# EAGLE design HC-06_Arduino_UNO_Adapter (EAGLE 7.4.0)
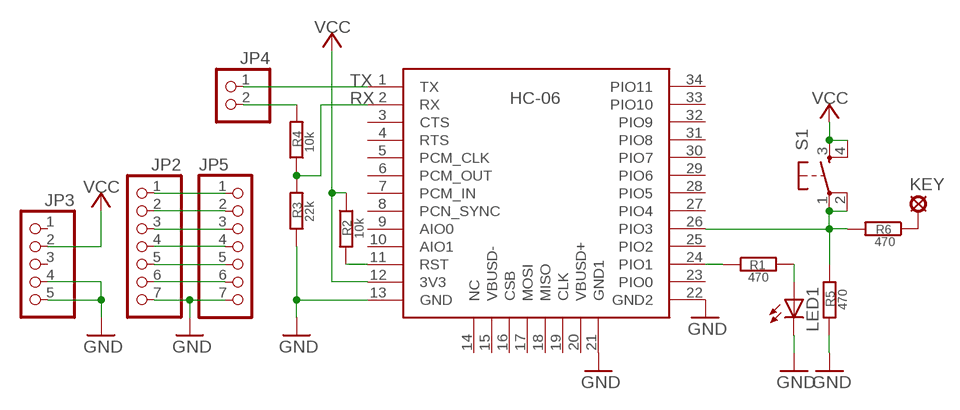
[diagram p0: schematic, sheet 1]

## Parts
HC-06  HC_05  [BLUETOOTH_SMD]
JP2  PINHD-1X7  [1X07]
JP3  PINHD-1X5  [1X05]
JP4  PINHD-1X2  [1X02]
JP5  PINHD-1X7  [1X07]
KEY  LSP10  [LSP10]
LED1  LED3MM  [LED3MM]
R1  470  R-EU_0204/5  [0204/5]
R2  10k  R-EU_0204/5  [0204/5]
R3  22k  R-EU_0204/5  [0204/5]
R4  10k  R-EU_0204/5  [0204/5]
R5  470  R-EU_0204/5  [0204/5]
R6  470  R-EU_0204/5  [0204/5]
S1  TACTILE-SWITCH-PTH  [TAC-SWITCH-PTH]

## Nets
GND: HC-06.13(GND) HC-06.21(GND1) HC-06.22(GND2) JP2.7 JP3.4 JP3.5 JP5.7 LED1.K(C) R3.1 R5.2
KEY: KEY.MP R6.1
N$1: LED1.A R1.2
N$2: HC-06.24(PIO1) R1.1
N$3: HC-06.11(RST) R2.2
N$4: JP2.1 JP5.1
N$5: JP2.2 JP5.2
N$6: JP2.3 JP5.3
N$7: JP2.4 JP5.4
N$8: HC-06.26(PIO3) R5.1 R6.2 S1.1 S1.2
N$9: JP4.2 R4.2
N$11: JP2.5 JP5.5
N$12: JP2.6 JP5.6
RX: HC-06.2(RX) R3.2 R4.1
TX: HC-06.1(TX) JP4.1
VCC: HC-06.12(3V3) JP3.2 R2.1 S1.3 S1.4
Unconnected: HC-06.3(CTS) HC-06.4(RTS) HC-06.5(PCM_CLK) HC-06.6(PCM_OUT) HC-06.7(PCM_IN) HC-06.8(PCN_SYNC) HC-06.9(AIO0) HC-06.10(AIO1) HC-06.14(NC) HC-06.15(VBUSD-) HC-06.16(CSB) HC-06.17(MOSI) HC-06.18(MISO) HC-06.19(CLK) HC-06.20(VBUSD+) HC-06.23(PIO0) HC-06.25(PIO2) HC-06.27(PIO4) HC-06.28(PIO5) HC-06.29(PIO6) HC-06.30(PIO7) HC-06.31(PIO8) HC-06.32(PIO9) HC-06.33(PIO10) HC-06.34(PIO11) JP3.1 JP3.3

## Library data of the parts
HC-06 = SerialPortBluetooth:HC_05
JP2 JP5 = pinhead:PINHD-1X7: PIN HEADER
JP3 = pinhead:PINHD-1X5: PIN HEADER
JP4 = pinhead:PINHD-1X2: PIN HEADER
KEY = solpad:LSP10: SOLDER PAD drill 1.0 mm, distributor Buerklin, 12H555
LED1 = dmx2rgb:LED: LED OSRAM: - CHIPLED LG R971, LG N971, LY N971, LG Q971, LY Q971, LO R971, LY R971 LH N974, LH R974 LS Q976, LO Q976, LY Q976 LO Q996 - Hyper CHIPLED LW Q18S LB Q993, LB Q99A, LB R99A - SideLED LS A670, LO A670, LY A670, LG A670, LP A670 LB A673, LV A673, LT A673, LW A673 LH A674 LY A675 LS A676, LA A676, LO A676, LY A676, LW A676 LS A679, LY A679, LG A679 - Hyper Micro SIDELED® LS Y876, LA Y876, LO Y876, LY Y876 LT Y87S - SmartLED LW L88C, LW L88S LB L89C, LB L89S, LG L890 LS L89K, LO L89K, LY L89K LS L896, LA L896, LO L896, LY L896 - TOPLED LS T670, LO T670, LY T670, LG T670, LP T670 LSG T670, LSP T670, LSY T670, LOP T670, LYG T670 LG T671, LOG T671, LSG T671 LB T673, LV T673, LT T673, LW T673 LH T674 LS T676, LA T676, LO T676, LY T676, LB T676, LH T676, LSB T676, LW T676 LB T67C, LV T67C, LT T67C, LS T67K, LO T67K, LY T67K, LW E67C LS E67B, LA E67B, LO E67B, LY E67B, LB E67C, LV E67C, LT E67C LW T67C LS T679, LY T679, LG T679 LS T770, LO T770, LY T770, LG T770, LP T770 LB T773, LV T773, LT T773, LW T773 LH T774 LS E675, LA E675, LY E675, LS T675 LS T776, LA T776, LO T776, LY T776, LB T776 LHGB T686 LT T68C, LB T68C - Hyper Mini TOPLED® LB M676 - Mini TOPLED Santana® LG M470 LS M47K, LO M47K, LY M47K Source: http://www.osram.convergy.de/
R1-R6 = rcl:R-EU_: RESISTOR, European symbol
S1 = GeekAmmo:TACTILE-SWITCH: Tactile Switch 4 Pins, SPST NO

## Board
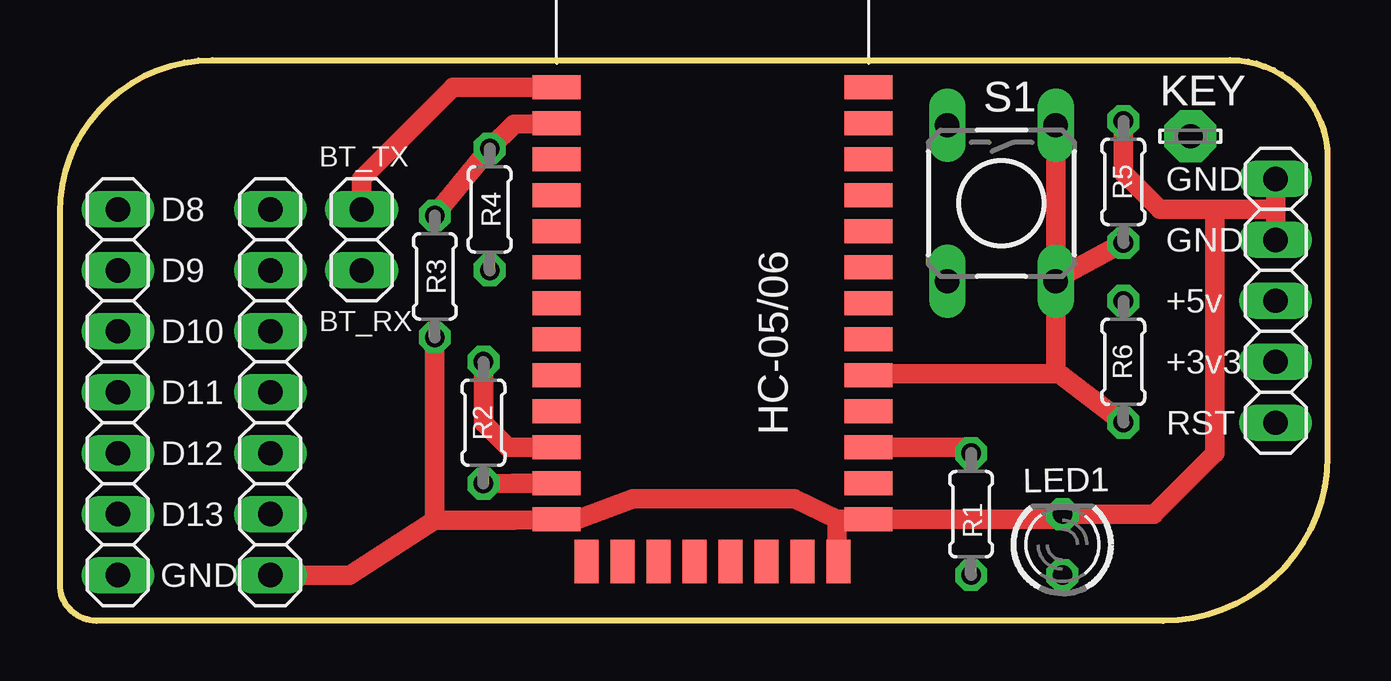
[diagram p1: board, top side]
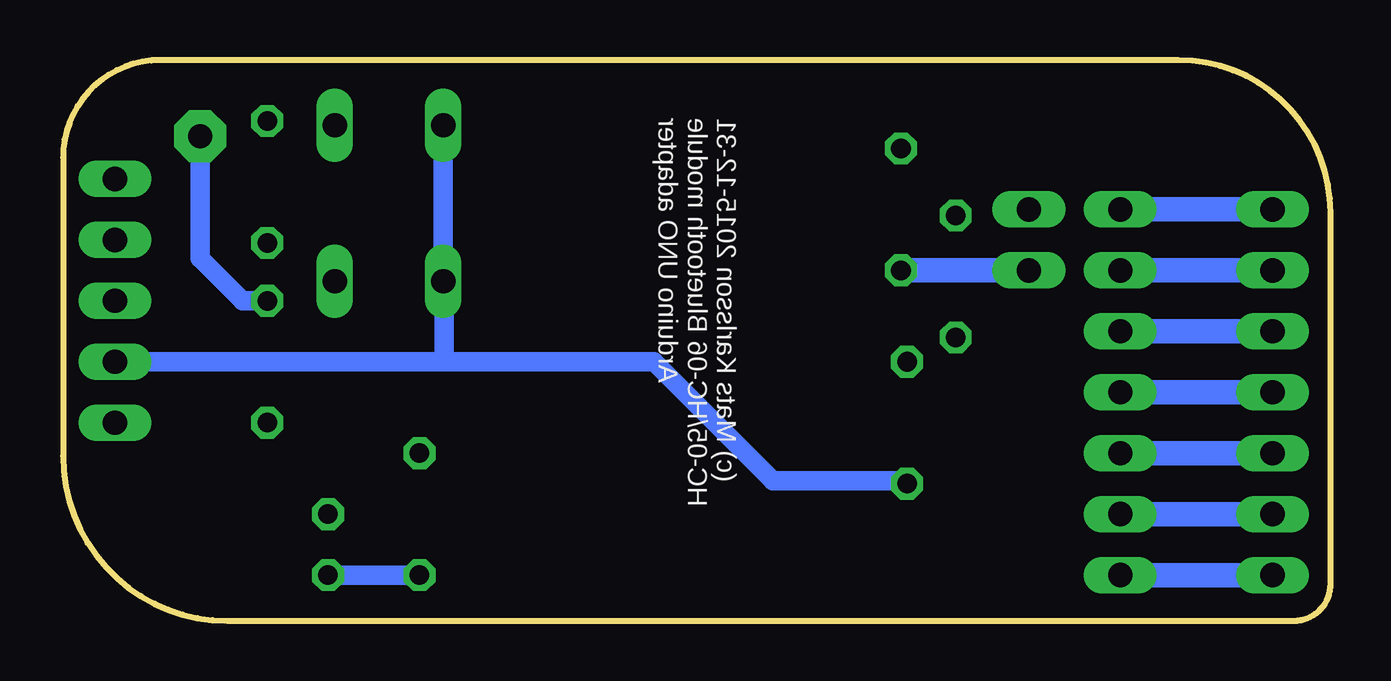
[diagram p2: board, bottom side, seen from below]

Size 52.83 x 23.37 mm. Coordinates in mm from the lower left corner, seen from the top.
Outline: 1.52,0 arc-90 0,1.52 0,17.02 arc-90 6.35,23.37 48.77,23.37 arc-90 52.83,19.3 52.83,6.86 arc-90 45.97,0 1.52,0
Copper layers (1*16): Top 0.035mm / dielectric 1.5mm / Bottom 0.035mm
Design rules "default": minimum track width 10mil, minimum drill 24mil, track to track 8mil, track to pad 8mil, pad to pad 8mil, via to via 8mil, smd to smd 8mil, copper to edge 40mil, drill to drill 8mil, minimum pad ring 10mil, minimum via ring 8mil, stop-mask expansion 4mil, vias tented up to drill 0mil, thermal gap 10mil

### Footprints (pad centres in the part's own frame; a part is rotated, then mirrored left to right if it is on the bottom)
BLUETOOTH_SMD = smd 2 x 1: 1 0,0; 2 0,-1.5; 3 0,-3; 4 0,-4.5; 5 0,-6; 6 0,-7.5; 7 0,-9; 8 0,-10.5; 9 0,-12; 10 0,-13.5; 11 0,-15; 12 0,-16.5; 13 0,-18; 22 13,-18; 23 13,-16.5; 24 13,-15; 25 13,-13.5; 26 13,-12; 27 13,-10.5; 28 13,-9; 29 13,-7.5; 30 13,-6; 31 13,-4.5; 32 13,-3; 33 13,-1.5; 34 13,0 | smd 1 x 1.8: 14 1.25,-19.75; 15 2.75,-19.75; 16 4.25,-19.75; 17 5.75,-19.75; 18 7.25,-19.75; 19 8.75,-19.75; 20 10.25,-19.75; 21 11.75,-19.75
1X07 = drill 1.016 long: 1 -7.62,0; 2 -5.08,0; 3 -2.54,0; 4 0,0; 5 2.54,0; 6 5.08,0; 7 7.62,0
1X05 = drill 1.016 long: 1 -5.08,0; 2 -2.54,0; 3 0,0; 4 2.54,0; 5 5.08,0
1X02 = drill 1.016 long: 1 -1.27,0; 2 1.27,0
LSP10 = drill 1.016 pad 2.159 octagon: MP 0,0
LED3MM = drill 0.813 octagon: A -1.27,0; K 1.27,0
0204/5 = drill 0.813 octagon: 1 -2.54,0; 2 2.54,0
TAC-SWITCH-PTH = drill 1.016 pad 1.524 long: 1 -3.251,2.261; 2 3.251,2.261; 3 -3.251,-2.261; 4 3.251,-2.261

### Placement (x,y rotation side)
HC-06  20.7,22.23 0 top
JP2  2.41,9.53 270 top
JP3  50.67,13.34 90 top
JP4  12.57,15.88 270 top
JP5  8.76,9.53 270 top
KEY  47.12,20.19 0 top
LED1  41.78,3.17 90 top
R1  37.97,4.45 270 top
R2  17.65,8.26 90 top
R3  15.62,14.35 90 top
R4  17.91,17.14 270 top
R5  44.32,18.29 90 top
R6  44.32,10.79 270 top
S1  39.24,17.4 270 top

### Tracks (layer width: path | path; a pad name or v marks a point on that pad's centre or on a via)
GND
  Top 0.813: 15.62,4.19 18.92,4.19 HC-06.13 21.59,4.22 23.88,5.08 30.61,5.08 32.38,4.22 | 15.62,4.19 12.06,1.91 JP5.7 | 15.62,4.19 R3.1 | 48.13,17.14 48.13,6.99 45.59,4.45 LED1.K 41.56,4.22 HC-06.22 32.38,4.22 | 50.67,17.14 JP3.4 | R5.2 44.32,18.67 45.85,17.14 48.13,17.14 | 48.13,17.14 50.67,17.14 | 50.67,17.14 JP3.5 | HC-06.21 32.38,2.48 32.38,4.22
  Bottom 1.016: JP5.7 JP2.7
KEY
  Bottom 0.813: R6.1 45.34,13.34 47.12,15.11 KEY.MP
N$1
  Bottom 0.813: R1.2 LED1.A
N$2
  Top 0.813: R1.1 37.7,7.22 HC-06.24
N$3
  Top 0.813: R2.2 17.65,8.26 18.67,7.24 20.69,7.24 HC-06.11
N$4
  Bottom 1.016: JP2.1 JP5.1
N$5
  Bottom 1.016: JP5.2 JP2.2
N$6
  Bottom 1.016: JP2.3 JP5.3
N$7
  Bottom 1.016: JP5.4 JP2.4
N$8
  Top 0.813: S1.1 41.5,14.22 R5.1 | HC-06.26 33.76,10.29 41.53,10.29 | 41.53,10.29 41.66,10.29 R6.2 | S1.2 41.5,10.57 41.53,10.29
  Top 1.016: 41.5,14.22 S1.2
N$9
  Bottom 1.016: JP4.2 R4.2
N$11
  Bottom 1.016: JP5.5 JP2.5
N$12
  Bottom 1.016: JP2.6 JP5.6
RX
  Top 0.61: 20.42,20.73 HC-06.2
  Top 0.813: R3.2 R4.1 18.92,20.7 20.42,20.73
TX
  Top 0.813: JP4.1 12.57,18.41 16.38,22.23 HC-06.1
VCC
  Top 0.813: HC-06.12 18.91,5.72 R2.1
  Bottom 0.813: S1.4 S1.3 | 36.7,10.79 28.19,10.79 23.24,5.84 17.78,5.84 | 36.96,14.15 36.96,11.05 36.7,10.79 | JP3.2 36.7,10.79
  Bottom 1.016: S1.4 36.96,14.15 | 17.78,5.84 R2.1

### Text on the board
tNames: BT_TX | GND | D8 | GND | D9 | +5v | D10 | BT_RX | +3v3 | D11 | HC-05/06 | RST | D12 | D13 | GND
bNames: (c) Mats Karlsson 2015-12-31 / HC-05/HC-06 Bluetooth module / Arduino UNO adapter
_tNames: S1 | KEY | R4 | R5 | R3 | R6 | R2 | R1 | LED1